# Altium schematic sheet schemat.SchDoc
size A4; SheetNumber: 1; SheetTotal: 1
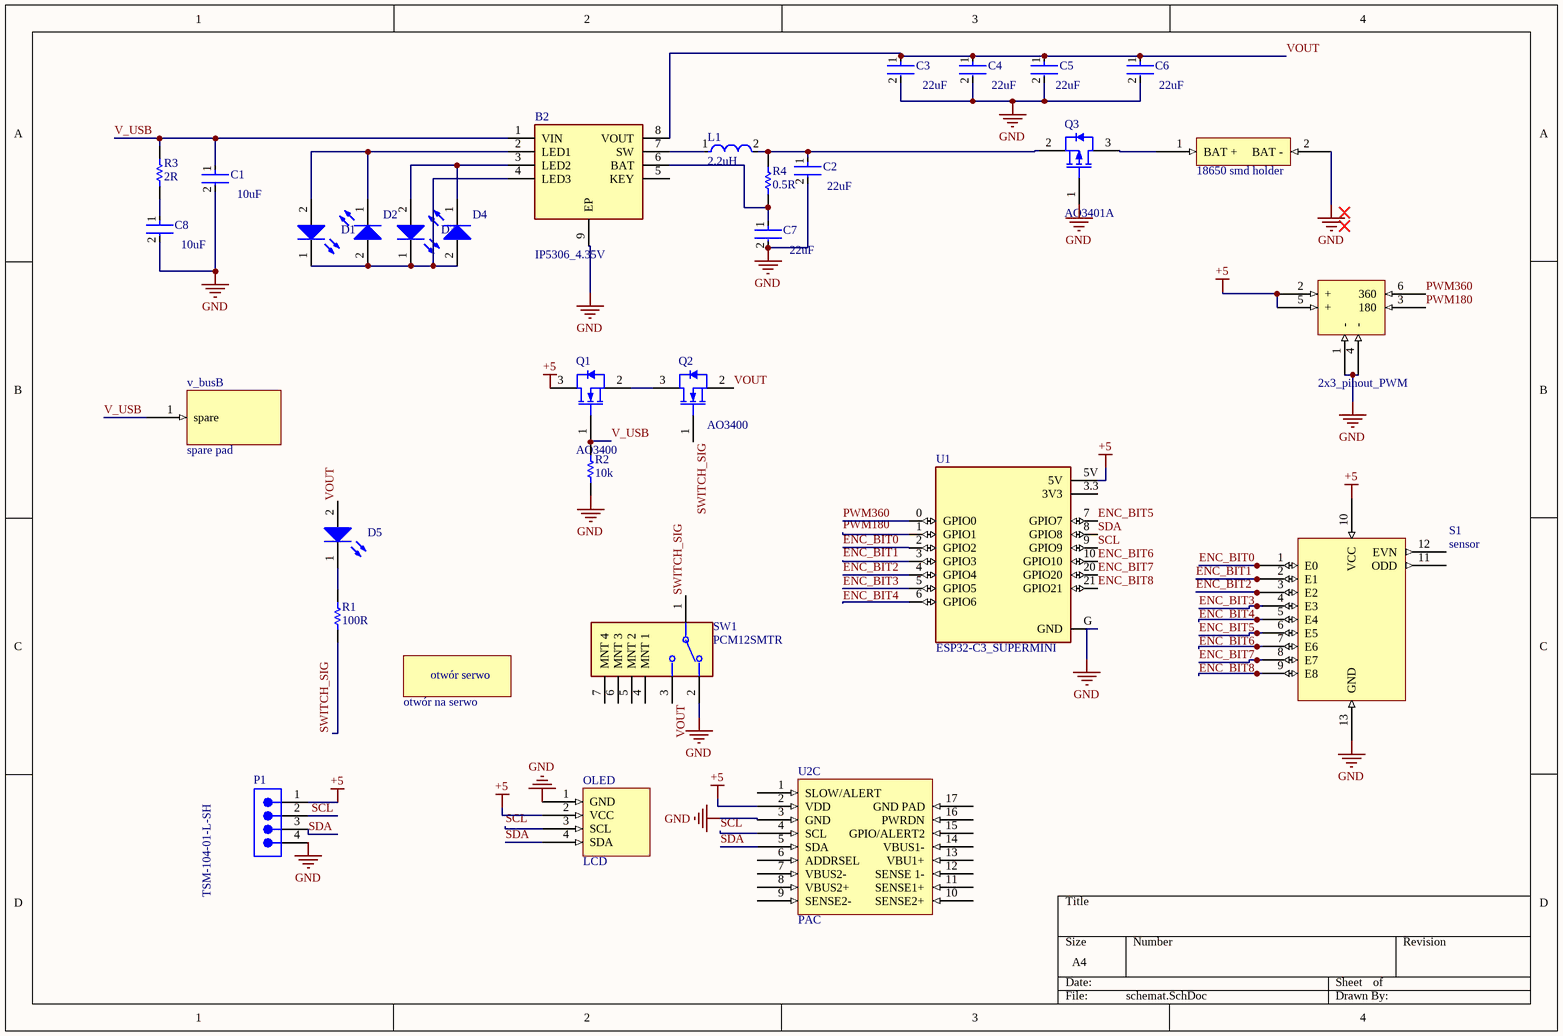
[diagram p0: schemat.SchDoc]

## Parts
*  otwór na serwo  [serwo]
B1  18650 smd holder  [18650 smd holder]
B2  IP5306_4.35V  [SOIC127P600X165-9N]
C1  10uF  [FP-GRM21B-0_15-MFG]
C2  22uF  [FP-GRM21B-0_15-MFG]
C3  22uF  [FP-GRM21B-0_15-MFG]
C4  22uF  [FP-GRM21B-0_15-MFG]
C5  22uF  [FP-GRM21B-0_15-MFG]
C6  22uF  [FP-GRM21B-0_15-MFG]
C7  22uF  [FP-GRM21B-0_15-MFG]
C8  10uF  [FP-GRM21B-0_15-MFG]
D1  150120BS75000  [WL-SMCW_1206_150120xx75000]  (value not drawn)
D2  150120BS75000  [WL-SMCW_1206_150120xx75000]  (value not drawn)
D3  150120BS75000  [WL-SMCW_1206_150120xx75000]  (value not drawn)
D4  150120BS75000  [WL-SMCW_1206_150120xx75000]  (value not drawn)
D5  150120BS75000  [WL-SMCW_1206_150120xx75000]  (value not drawn)
J1  2x3_pinout_PWM  [Goldpin raster 2x3]
L1  2.2uH  [FP-ASPI-0630LR-MFG]
OLED  LCD  [LCD]
P1  TSM-104-01-L-SH  [SMTC-TSM-104-01-X-SH]
Q1  AO3400  [AO-SOT23-3_V]
Q2  AO3400  [AO-SOT23-3_V]
Q3  AO3401A  [AO-SOT-23-3L_V]
R1  100R  [RESC2013X50X30LL20T20]
R2  10k  [RESC2013X50X30LL20T20]
R3  2R  [RESC2013X50X30LL20T20]
R4  0.5R  [RESC2013X50X30LL20T20]
S1  sensor  [czujnik zbliżeniowy]
SW1  PCM12SMTR  [FP-PCM12SMTR-MFG]
U1  ESP32-C3_SUPERMINI  [MODULE_ESP32-C3_SUPERMINI]
U2  PAC  [QFN50P300X300X90_HS-17N]  (part C of 3)
v_bus  spare pad  [spare pad]  (part B of 2)

## Nets
+5: J1.2(+) J1.5(+) OLED.2(VCC) P1.1 Q1.3(D) S1.10(VCC) U1.5V U2.2(VDD)
GND: B1.2(BAT_-) B2.9(EP) C1.2 C2.2 C3.2 C4.2 C5.2 C6.2 C7.2 C8.2 J1.1(-) J1.4(-) OLED.1(GND) Q3.1(GATE) R2.1 S1.13(GND) SW1.2 U1.G(GND) U2.3(GND)
ENC_BIT0: S1.1(E0) U1.2(GPIO2)
ENC_BIT1: S1.2(E1) U1.3(GPIO3)
ENC_BIT2: S1.3(E2) U1.4(GPIO4)
ENC_BIT3: S1.4(E3) U1.5(GPIO5)
ENC_BIT4: S1.5(E4) U1.6(GPIO6)
ENC_BIT5: S1.6(E5) U1.7(GPIO7)
ENC_BIT6: S1.7(E6) U1.10(GPIO10)
ENC_BIT7: S1.8(E7) U1.20(GPIO20)
ENC_BIT8: S1.9(E8) U1.21(GPIO21)
PWM180: J1.3(180) U1.1(GPIO1)
PWM360: J1.6(360) U1.0(GPIO0)
SCL: OLED.3(SCL) P1.2 U1.9(GPIO9) U2.4(SCL)
SDA: OLED.4(SDA) P1.3 U1.8(GPIO8) U2.5(SDA)
SWITCH_SIG: Q2.1(G) R1.2 SW1.1
V_USB: B2.1(VIN) C1.1 Q1.1(G) R2.2 R3.1 v_bus.1(spare)
VOUT: B2.8(VOUT) C3.1 C4.1 C5.1 C6.1 D5.2(A) Q2.2(S) SW1.3
NetB1_1: B1.1(BAT_+) Q3.3(DRAIN)
NetB2_2: B2.2(LED1) D1.2(A) D2.1(K)
NetB2_3: B2.3(LED2) D3.2(A) D4.1(K)
NetB2_4: B2.4(LED3) D1.1(K) D2.2(A) D3.1(K) D4.2(A)
NetB2_6: B2.6(BAT) C7.1 R4.2
NetB2_7: B2.7(SW) L1.1
NetC2_1: C2.1 L1.2 Q3.2(SOURCE) R4.1
NetC8_1: C8.1 R3.2
NetD5_1: D5.1(K) R1.1
NetQ1_2: Q1.2(S) Q2.3(D)

Not connected (* = marked no-connect by the designer): B2 5(KEY); P1 4; S1 11(ODD) 12(EVN); SW1 4(MNT_1) 5(MNT_2) 6(MNT_3) 7(MNT_4); U1 3.3(3V3); U2 1(SLOW/ALERT) 6(ADDRSEL) 7(VBUS2-) 8(VBUS2+) 9(SENSE2-) 10(SENSE2+) 11(SENSE1+) 12(SENSE_1-) 13(VBU1+) 14(VBUS1-) 15(GPIO/ALERT2) 16(PWRDN) 17(GND_PAD)

## Notes on the sheet
- Labels drawn without touching a wire or pin: GND
- (in symbol otwór na serwo) otwór serwo

## Library data of the parts
B2 = IP5306_4.35V: 2.1A Charging 2.4 A Discharge Highly Integrated Mobile Power Supply; Manufacturer_Name: INJOINIC; Geometry.Height: 1.65mm; Manufacturer_Part_Number: IP5306_4.35V; Mouser Part Number: *; Mouser Price/Stock: *; Arrow Part Number: *; Arrow Price/Stock: *; Datasheet Link: https://datasheet.lcsc.com/szlcsc/1906271838_INJOINIC-IP5306-4-35V_C384572.pdf
C1-C8 = CMP-2007-03385-2: Chip Multilayer Ceramic Capacitors for General Purpose, 0805, 22uF, X5R, 15%, 20%, 6.3V; Material: Ceramic; Max Operating Temperature: 85°C; Voltage: 6.3V; Min Operating Temperature: -55°C; Case/Package: 0805; Thickness: 0.053inch; Dielectric: X5R; Packaging: Tape and Reel; Depth: 1.25mm; Termination: SMD/SMT; Voltage Rating (DC): 6.3V; Radiation Hardening: No; Tolerance: 20%; Mount: Surface Mount; Lead Free: Lead Free; Package Quantity: 1; REACH SVHC: No SVHC; Voltage Rating: 6.3V; Capacitance: 22uF; Length: 2mm; Case Code (Imperial): 0805; Case Code (Metric): 2012; Width: 0.049inch; Height: 1.25mm
D1-D5 = CMP-1426-00015-2: NexarPartId: 29717786; Manufacturer Package Identifier: LED_1206; Peak Wavelength: 465nm; Dominant Wavelength: 470nm; Viewing Angle: 140°; Lens Style: Clear, Rectangular; Max Reverse Voltage (DC): 5V; Test Current: 20mA; Forward Voltage: 3.2V; Color: Blue; Forward Current: 100mA; Luminous Intensity: 145mcd; Case Code (Metric): 3216; Case/Package: 1206; Length: 3.2mm; Packaging: Tape and Reel; Case Code (Imperial): 1206; Min Operating Temperature: -40°C; REACH SVHC: Unknown; Height: 680µm; Mount: Surface Mount; Max Operating Temperature: 85°C; RoHS: Compliant; Width: 1.6mm; Wavelength: 470nm
L1 = CMP-27750-000262-1: FIXED IND 10UH 4A 68 MOHM SMD; Test Frequency: 100kHz; Saturation Current: 5.5A; DC Resistance (DCR): 68mR; Shielding: Unshielded; Core Material: Carbonyl Powder; Tolerance: 20%; Current Rating: 4A; Inductance: 10uH; Max Operating Temperature: 125°C; Radiation Hardening: No; Case/Package: Nonstandard; Width: 0.262inch; Lead Free: Lead Free; Max DC Current: 5.5A; Height: 3mm; Termination: SMD/SMT; Depth: 6.65mm; Mount: Surface Mount; Height - Seated (Max): 0.118inch; Packaging: Tape and Reel; Min Operating Temperature: -55°C; Length: 0.283inch; Series: ASPI-0630LR; RoHS Compliant: Yes
P1 = CMP-1024-00225-1: 0.025" SQ Post Header, Surface Mount, Horizontal, -55 to 125 degC, 2.54 mm Pitch, 4-Pin, Male, RoHS; Manufacturer: Samtec; Pitch: 2.54 mm; Orientation: Horizontal; DatasheetVersion: F-214; PackageVersion: CD, 7/1991; Temperature Range: -55 to 125 degC; ComponentLink2URL: http://www.samtec.com/documents/webfiles/pdf/TSM.PDF; ComponentLink3URL: http://www.samtec.com/documents/webfiles/cpdf/TSM-1XX-XX-XXX-SH-XX-XXX-XX-MKT1.pdf; PartNumber: TSM-104-01-L-SH; ComponentLink2Description: Datasheet; ComponentLink3Description: Package Specification; PackageReference: TSM-104-01-X-SH; PackageDescription: Terminal Strip Single Surface Mount; ComponentLink1Description: Manufacturer URL; RoHS: True; Mounting Technology: Surface Mount; ComponentLink1URL: http://www.samtec.com
Q1 Q2 = CMP-0278-00001-1: N-channel Enhancement Mode Field-Effect Transistor; 5.8A/30V; Manufacturer: Alpha and Omega; Channel Type: N; Drain-Source Voltage Limit: 30 V; Junction Temperature: -55 to 150 degC; Gate-Source Voltage Limit: +/-12 V; PackageDescription: 3-Pin SOT23, 3.016 x 2.8 mm Body, 0.95 mm Pitch; ComponentLink2Description: Datasheet; DatasheetVersion: Rev.8, 12/2011; ComponentLink3URL: http://www.aosmd.com/res/packaging_information/SOT-23.pdf; Storage Temperature: -55 to 150 degC; ComponentLink3Description: Package Specification; PackageReference: SOT23; ComponentLink1Description: Manufacturer URL; Mounting Technology: Surface Mount; ComponentLink1URL: http://www.aosmd.com/; PartNumber: AO3400; ComponentLink2URL: http://www.aosmd.com/res/data_sheets/AO3400.pdf
Q3 = CMP-2000-05778-1: P-Channel MOSFET, 30 V, 4 A, -55 to 150 degC, 3-Pin SOT-23-3L, RoHS, Tape and Reel; Manufacturer: Alpha and Omega; Output Power (Max): NotRequiredW; Power Dissipation: 1.4W; Rad Hardened: No; Drain Efficiency: NotRequired%; Drain-Source On-Volt: 30V; Noise Figure: NotRequireddB; Frequency (Max): NotRequiredMHz; Number of  Elements: 1; Gate-Source Voltage (Max): ?12V; Drain Current (Max): 4A; Channel Mode: Enhancement; Drain-Source On-Res: 0.044ohm; Type: PowerMOSFET; Polarity: P; Package URL: http://www.aosmd.com/res/packaging_information/SOT-23-3L.pdf; Datasheet URL: http://www.aosmd.com/res/data_sheets/AO3401A.pdf; Package Type: SOT-23; Package Description: 3-Pin Small Outline Transistor, Body 2.95 x 1.6 mm, Pitch 0.95 mm; Mounting: SurfaceMount; Manufacturer URL: http://www.aosmd.com/; Continuous Drain Current: 4A; Package Reference: SOT-23-3L; Mounting Technology: SurfaceMount; Operating Temperature Classification: Military; Power Gain: NotRequireddB; Datasheet Version: Rev. 3, 03/2011; Operating Temp Range: -55Cto150C; Pin Count: 3
R1-R4 = CMP-2001-04896-1: Manufacturer: Vishay Dale; Part Number: CRCW08050000Z0EA
SW1 = CMP-2000-06884-2: SWITCH SLIDE SPDT 300MA 6V; Actuator Material: Nylon; Switch Function: On-On; Insulation Resistance: 100mR; Actuator Type: Standard; Mechanical Life: 10000Cycles; Actuator Length: 1.5mm; Contact Resistance: 70mR; Min Operating Temperature: -20°C; Max Current Rating: 300mA; Max Voltage Rating (DC): 6V; Package Quantity: 1; Mount: Surface Mount; Packaging: Tape and Reel; Contact Plating: Silver; Depth: 5mm; REACH SVHC: No SVHC; Voltage Rating (DC): 6V; Voltage Rating (AC): 6V; Max Operating Temperature: 85°C; Length: 7.7mm; Termination: Gull Wing; Current Rating: 300mA; Contact Current Rating: 300mA; Orientation: Right Angle; Width: 6.7mm; Switch Travel: 1.5mm; Lead Free: Lead Free; Contact Material: Copper Alloy; Throw Configuration: SPDT
U1 = ESP32-C3_SUPERMINI: Super tiny ESP32-C3 board; MF: Espressif Systems; MP: ESP32-C3 SuperMini; SnapEDA_Link: https://www.snapeda.com/parts/ESP32-C3%20SuperMini/Espressif+Systems/view-part/?ref=snap; Package: Package; Value: *; Check_prices: https://www.snapeda.com/parts/ESP32-C3%20SuperMini/Espressif+Systems/view-part/?ref=eda